# EAGLE design carrier v2.1 (EAGLE 9.1.1)
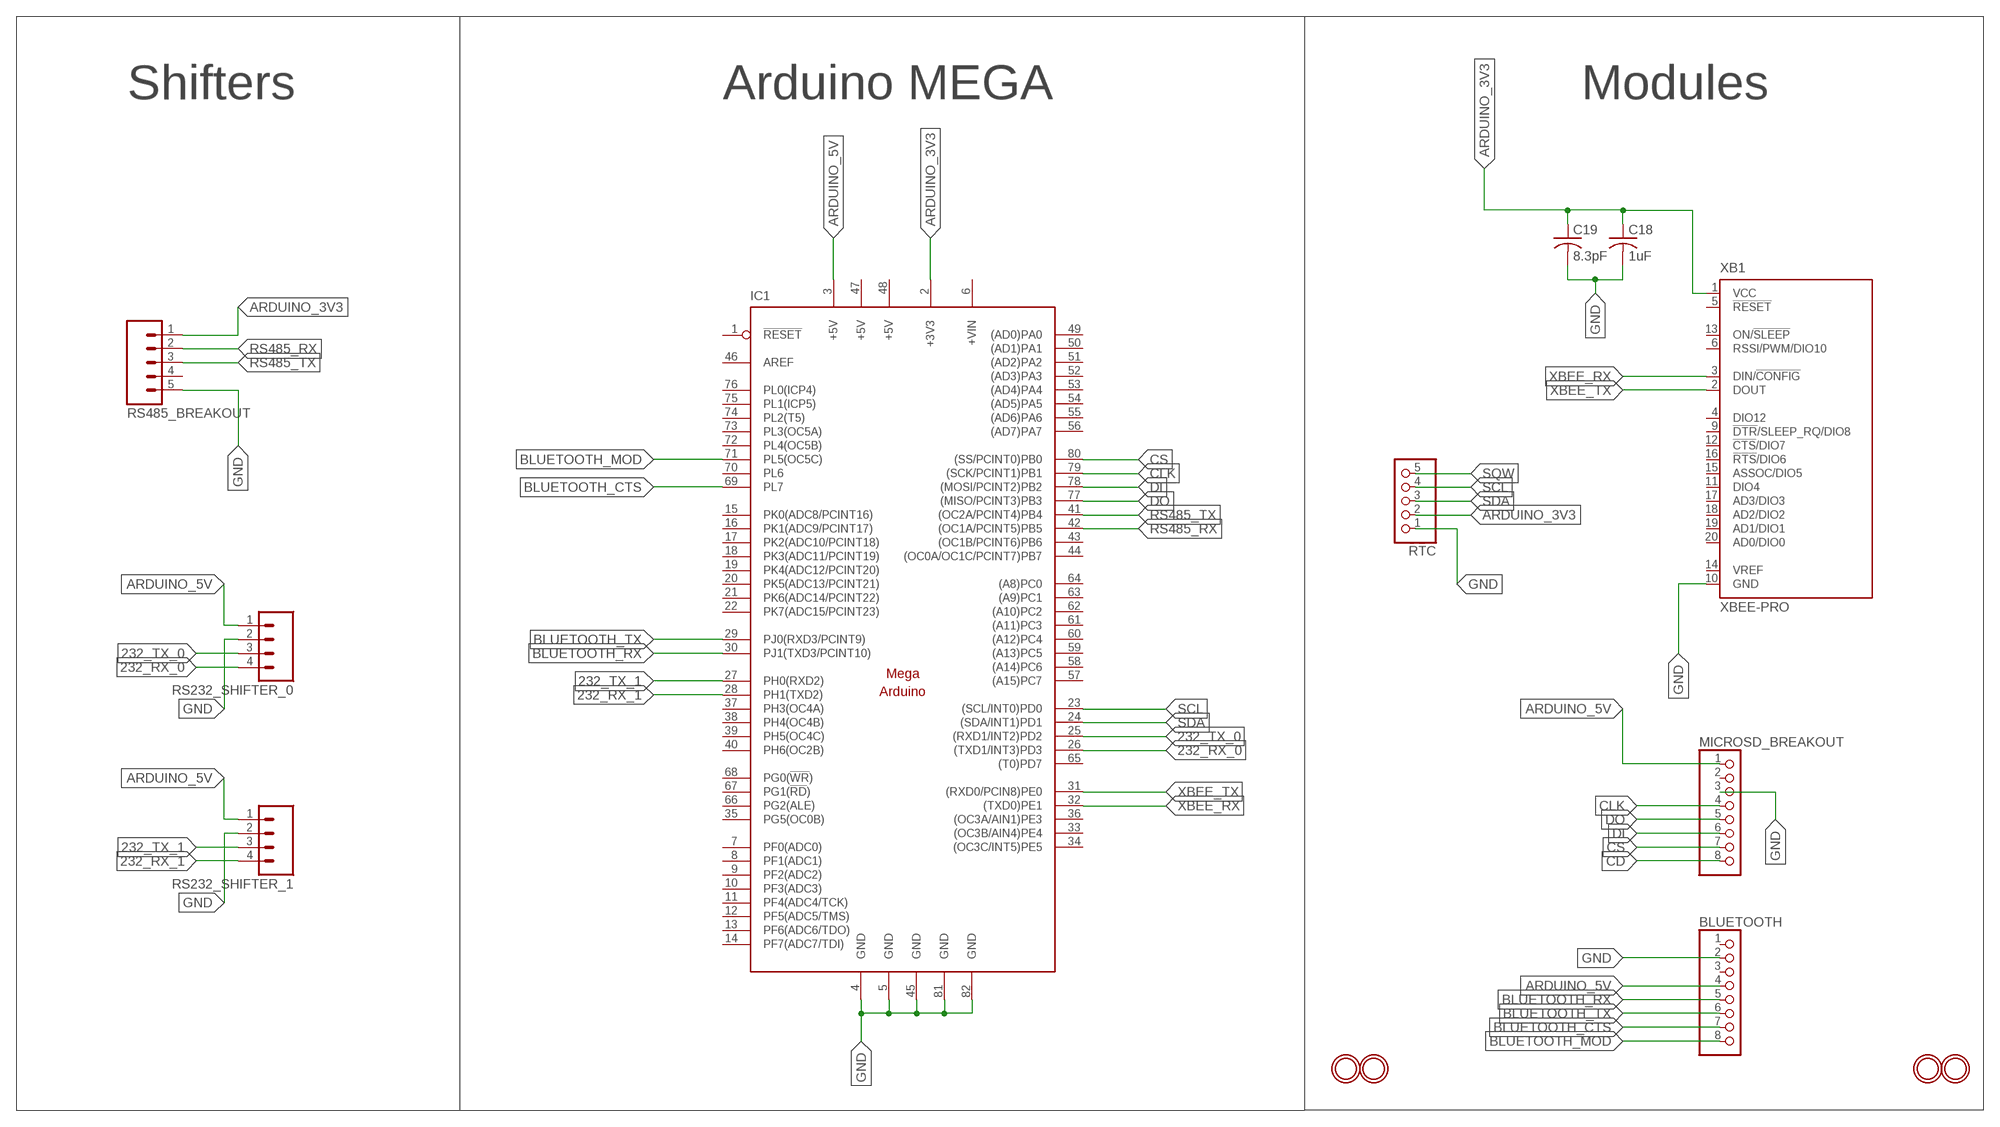
[diagram p0: schematic, sheet 1]

## Parts
BLUETOOTH  HEADER-1X876MIL  [1X08_ROUND_76]
C18  1uF  C-USC0805  [C0805]
C19  8.3pF  C-USC0805  [C0805]
IC1  MEGAARDUINO_1  [MEGA_ARDUINO]
MICROSD_BREAKOUT  PINHD-1X8BIG  [1X08-BIG]
RS232_SHIFTER_0  M04PTH  [1X04]
RS232_SHIFTER_1  M04PTH  [1X04]
RS485_BREAKOUT  M05PTH  [1X05]
RTC  HEADER-1X576MIL  [1X05_ROUND_76]
U$1  MOUNTINGHOLE2.0  [MOUNTINGHOLE_2.0_PLATED]
U$4  MOUNTINGHOLE2.0  [MOUNTINGHOLE_2.0_PLATED]
U$28  MOUNTINGHOLE2.5  [MOUNTINGHOLE_2.5_PLATED]
U$29  MOUNTINGHOLE2.5  [MOUNTINGHOLE_2.5_PLATED]
XB1  XBEE-PRO  [XBEE-PRO]

## Nets
232_RX_0: IC1.26((TXD1/INT3)PD3) RS232_SHIFTER_0.4
232_RX_1: IC1.28(PH1(TXD2)) RS232_SHIFTER_1.4
232_TX_0: IC1.25((RXD1/INT2)PD2) RS232_SHIFTER_0.3
232_TX_1: IC1.27(PH0(RXD2)) RS232_SHIFTER_1.3
ARDUINO_3V3: C18.1 C19.1 IC1.2(+3V3) RS485_BREAKOUT.1 RTC.2 XB1.1(VCC)
ARDUINO_5V: BLUETOOTH.4 IC1.3(+5V) MICROSD_BREAKOUT.1 RS232_SHIFTER_0.1 RS232_SHIFTER_1.1
BLUETOOTH_CTS: BLUETOOTH.7 IC1.69(PL7)
BLUETOOTH_MOD: BLUETOOTH.8 IC1.71(PL5(OC5C))
BLUETOOTH_RX: BLUETOOTH.5 IC1.30(PJ1(TXD3/PCINT10))
BLUETOOTH_TX: BLUETOOTH.6 IC1.29(PJ0(RXD3/PCINT9))
CD: MICROSD_BREAKOUT.8
CLK: IC1.79((SCK/PCINT1)PB1) MICROSD_BREAKOUT.4
CS: IC1.80((SS/PCINT0)PB0) MICROSD_BREAKOUT.7
DI: IC1.78((MOSI/PCINT2)PB2) MICROSD_BREAKOUT.6
DO: IC1.77((MISO/PCINT3)PB3) MICROSD_BREAKOUT.5
GND: BLUETOOTH.2 C18.2 C19.2 IC1.4(GND) IC1.5(GND) IC1.45(GND) IC1.81(GND) IC1.82(GND) MICROSD_BREAKOUT.3 RS232_SHIFTER_0.2 RS232_SHIFTER_1.2 RS485_BREAKOUT.5 RTC.1 XB1.10(GND)
RS485_RX: IC1.42((OC1A/PCINT5)PB5) RS485_BREAKOUT.2
RS485_TX: IC1.41((OC2A/PCINT4)PB4) RS485_BREAKOUT.3
SCL: IC1.23((SCL/INT0)PD0) RTC.4
SDA: IC1.24((SDA/INT1)PD1) RTC.3
SQW: RTC.5
XBEE_RX: IC1.32((TXD0)PE1) XB1.3(DIN/!CONFIG)
XBEE_TX: IC1.31((RXD0/PCIN8)PE0) XB1.2(DOUT)
Unconnected: BLUETOOTH.1 BLUETOOTH.3 IC1.1(!RESET) IC1.7(PF0(ADC0)) IC1.8(PF1(ADC1)) IC1.9(PF2(ADC2)) IC1.10(PF3(ADC3)) IC1.11(PF4(ADC4/TCK)) IC1.12(PF5(ADC5/TMS)) IC1.13(PF6(ADC6/TDO)) IC1.14(PF7(ADC7/TDI)) IC1.15(PK0(ADC8/PCINT16)) IC1.16(PK1(ADC9/PCINT17)) IC1.17(PK2(ADC10/PCINT18)) IC1.18(PK3(ADC11/PCINT19)) IC1.19(PK4(ADC12/PCINT20)) IC1.20(PK5(ADC13/PCINT21)) IC1.21(PK6(ADC14/PCINT22)) IC1.22(PK7(ADC15/PCINT23)) IC1.33((OC3B/AIN4)PE4) IC1.34((OC3C/INT5)PE5) IC1.35(PG5(OC0B)) IC1.36((OC3A/AIN1)PE3) IC1.37(PH3(OC4A)) IC1.38(PH4(OC4B)) IC1.39(PH5(OC4C)) IC1.40(PH6(OC2B)) IC1.43((OC1B/PCINT6)PB6) IC1.44((OC0A/OC1C/PCINT7)PB7) IC1.46(AREF) IC1.49((AD0)PA0) IC1.50((AD1)PA1) IC1.51((AD2)PA2) IC1.52((AD3)PA3) IC1.53((AD4)PA4) IC1.54((AD5)PA5) IC1.55((AD6)PA6) IC1.56((AD7)PA7) IC1.57((A15)PC7) IC1.58((A14)PC6) IC1.59((A13)PC5) IC1.60((A12)PC4) IC1.61((A11)PC3) IC1.62((A10)PC2) IC1.63((A9)PC1) IC1.64((A8)PC0) IC1.65((T0)PD7) IC1.66(PG2(ALE)) IC1.67(PG1(!RD!)) IC1.68(PG0(!WR!)) IC1.70(PL6) IC1.72(PL4(OC5B)) IC1.73(PL3(OC5A)) IC1.74(PL2(T5)) IC1.75(PL1(ICP5)) IC1.76(PL0(ICP4)) MICROSD_BREAKOUT.2 RS485_BREAKOUT.4 XB1.4(DIO12) XB1.5(!RESET) XB1.6(RSSI/PWM/DIO10) XB1.9(!DTR!/SLEEP_RQ/DIO8) XB1.11(DIO4) XB1.12(!CTS!/DIO7) XB1.13(ON/!SLEEP) XB1.14(VREF) XB1.15(ASSOC/DIO5) XB1.16(!RTS!/DIO6) XB1.17(AD3/DIO3) XB1.18(AD2/DIO2) XB1.19(AD1/DIO1) XB1.20(AD0/DIO0)

## Notes on the sheet
- Shifters | Arduino MEGA | Modules

## Power pins joined to a net without a drawn wire
+5V: IC1.47(+5V) IC1.48(+5V)
+VIN: IC1.6(+VIN)

## Library data of the parts
BLUETOOTH = microbuilder:HEADER-1X8: PIN HEADER
C18 C19 = resistor:C-US: CAPACITOR, American symbol
IC1 = arduino:MEGAARDUINO_1: The Arduino Mega is a microcontroller board based on the ATmega1280. - 54 digital input/output pins (of which 14 can be used as PWM outputs) - 16 analog inputs - 4 UARTs (hardware serial ports) - 16 MHz crystal oscillator - USB connection - power jack - ICSP header - reset button It contains everything needed to support the microcontroller; simply connect it to a computer with a USB cable or power it with a AC-to-DC adapter or battery to get started. The Mega is compatible with most shields designed for the Arduino Duemilanove or Diecimila. http://arduino.cc/en/Main/ArduinoBoardMega
MICROSD_BREAKOUT = adafruit:PINHD-1X8: PIN HEADER
RS232_SHIFTER_0 RS232_SHIFTER_1 = SparkFun-Connectors:M04: Header 4 Standard 4-pin 0.1" header. Use with straight break away headers (SKU : PRT-00116), right angle break away headers (PRT-00553), swiss pins (PRT-00743), machine pins (PRT-00117), and female headers (PRT-00115). Molex polarized connector foot print use with SKU : PRT-08231 with associated crimp pins and housings. 1MM SMD Version SKU: PRT-10208
RS485_BREAKOUT = SparkFun:M05: Header 5 Standard 5-pin 0.1" header. Use with straight break away headers (SKU : PRT-00116), right angle break away headers (PRT-00553), swiss pins (PRT-00743), machine pins (PRT-00117), and female headers (PRT-00115). Molex polarized connector foot print use with SKU : PRT-08230 with associated crimp pins and housings.
RTC = microbuilder:HEADER-1X5: PIN HEADER
U$1 U$4 U$28 U$29 = microbuilder:MOUNTINGHOLE: Mounting Hole For #2 screws (0.086"/2.18mm width, 0.094"/2.4mm hole) use 2.5mm; BOM: EXCLUDE
XB1 = xbee:XBEE: XBee (TM) /XBee-PRO(TM) OEM RF Modules Source: MaxStream, Inc. xbee_productmanual.pdf; MPN: XBP24-AWI-001; OC_FARNELL: 1337916; OC_NEWARK: 42M2667

## Net classes
1 power: width 0.254 mm

## Board
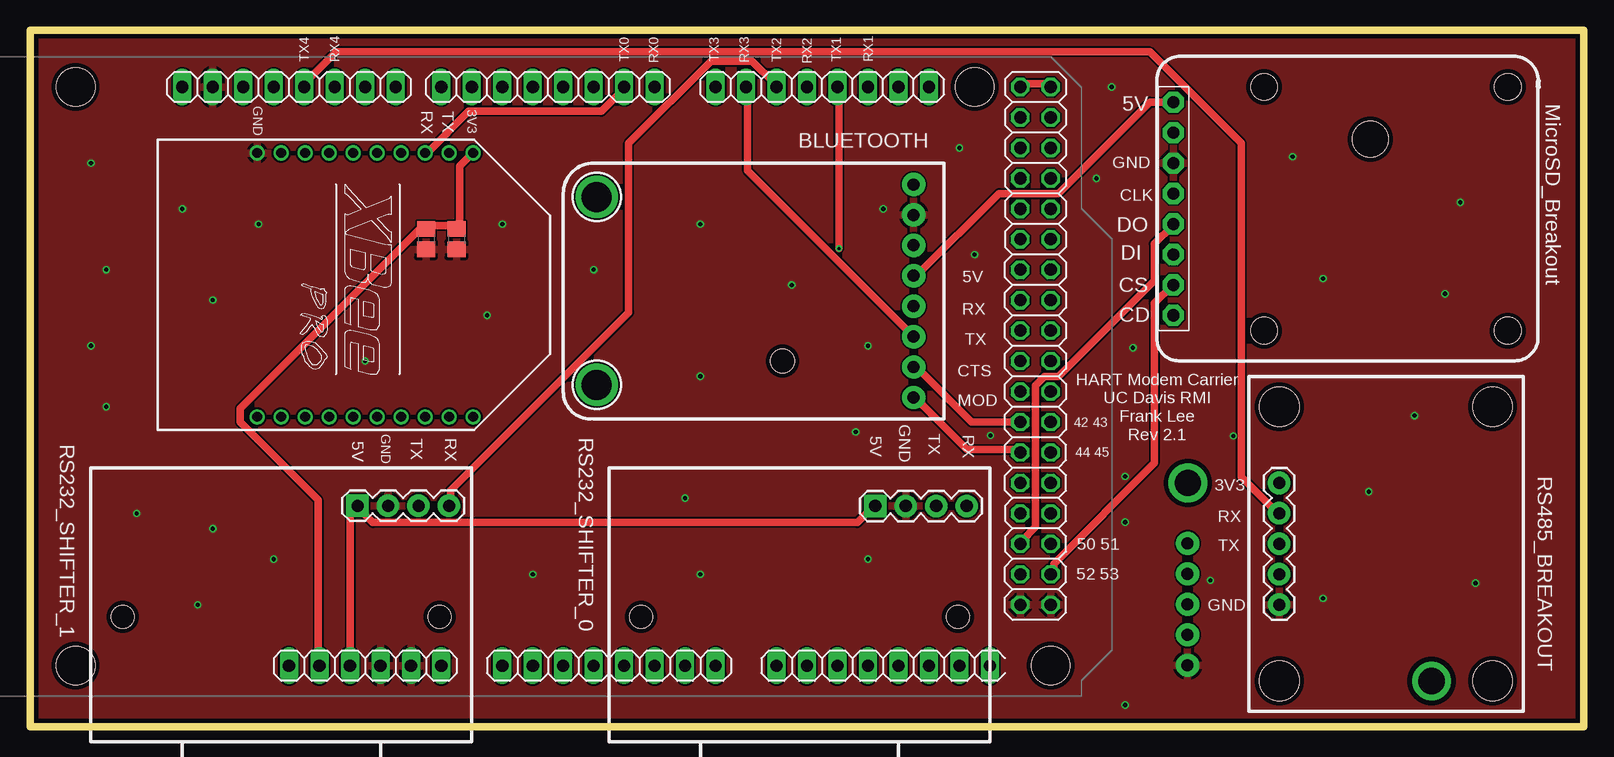
[diagram p1: board, top side]
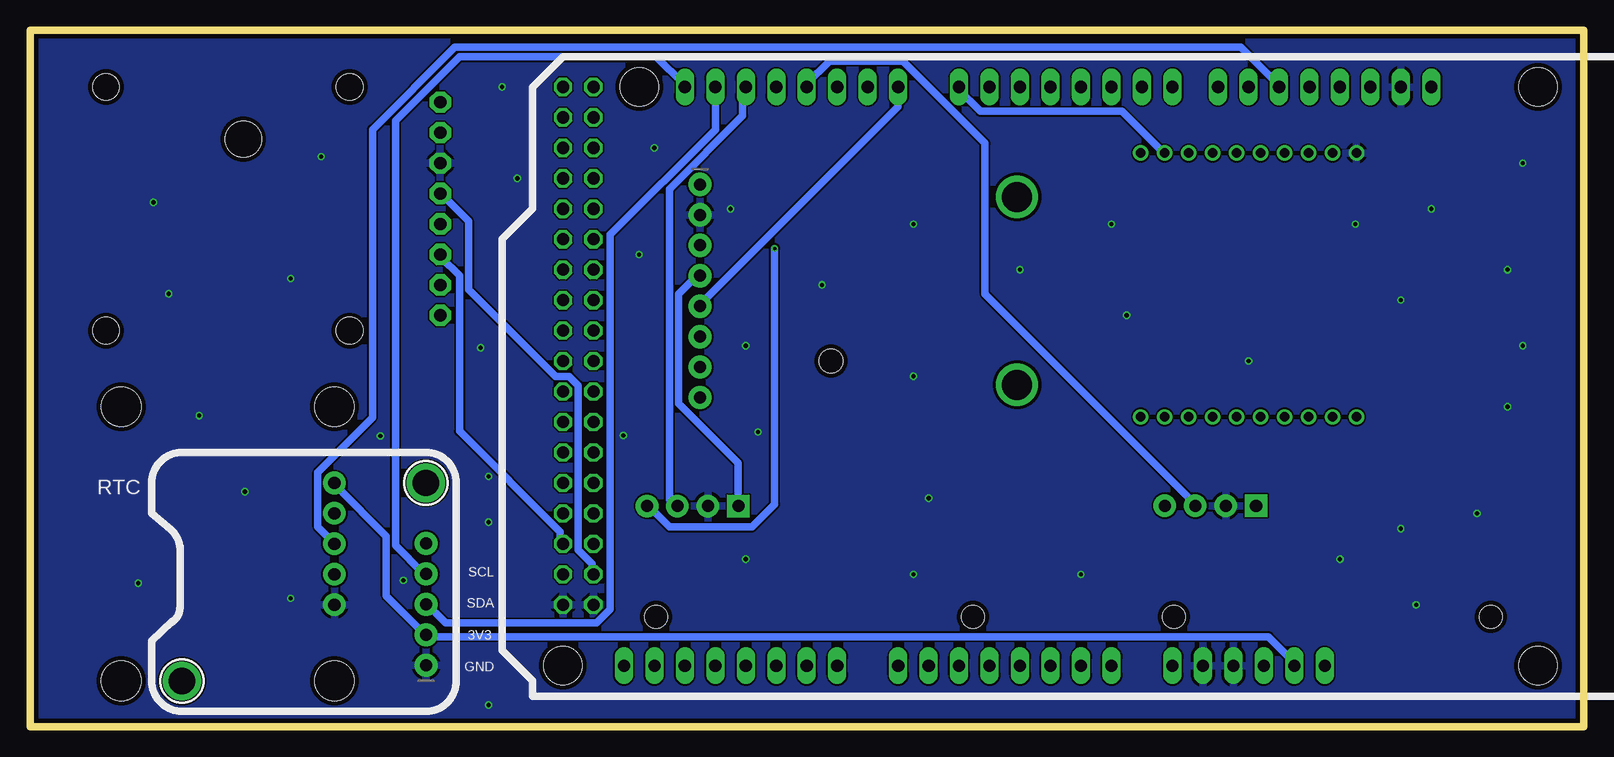
[diagram p2: board, bottom side, seen from below]

Size 129.52 x 58.09 mm. Coordinates in mm from the lower left corner, seen from the top.
Outline: 0,0 129.52,0 129.52,58.09 0,58.09 0,0
Copper layers (1*16): Top 0.035559375mm / dielectric 1.6mm / Bottom 0.035559375mm
Design rules "oshpark-2layer *": minimum track width 24mil, minimum drill 10mil, track to track 6mil, track to pad 6mil, pad to pad 6mil, via to via 6mil, smd to smd 6mil, copper to edge 15mil, drill to drill 6mil, minimum pad ring 5mil, minimum via ring 5mil, stop-mask expansion 2.5mil, vias tented up to drill 0mil, thermal gap 10mil
Holes 1.91 mm at 7.75,9.14 34.16,9.14 50.93,9.14 77.34,9.14
Holes 2.21 mm at 123.19,53.34 123.19,33.02 102.87,33.02 102.87,53.34
Holes 3 mm at 111.73,49

### Footprints (pad centres in the part's own frame; a part is rotated, then mirrored left to right if it is on the bottom)
1X08_ROUND_76 = drill 1 pad 1.93: 1 -8.89,0; 2 -6.35,0; 3 -3.81,0; 4 -1.27,0; 5 1.27,0; 6 3.81,0; 7 6.35,0; 8 8.89,0
C0805 = smd 1.3 x 1.5: 1 -0.85,0; 2 0.85,0
MEGA_ARDUINO = drill 1.016 long: 1 33.02,2.54; 2 35.56,2.54; 3 38.1,2.54; 4 40.64,2.54; 5 43.18,2.54; 6 45.72,2.54; 7 50.8,2.54; 8 53.34,2.54; 9 55.88,2.54; 10 58.42,2.54; 11 60.96,2.54; 12 63.5,2.54; 13 66.04,2.54; 14 68.58,2.54; 15 73.66,2.54; 16 76.2,2.54; 17 78.74,2.54; 18 81.28,2.54; 19 83.82,2.54; 20 86.36,2.54; 21 88.9,2.54; 22 91.44,2.54; 23 86.36,50.8; 24 83.82,50.8; 25 81.28,50.8; 26 78.74,50.8; 27 76.2,50.8; 28 73.66,50.8; 29 71.12,50.8; 30 68.58,50.8; 31 63.5,50.8; 32 60.96,50.8; 33 58.42,50.8; 34 55.88,50.8; 35 53.34,50.8; 36 50.8,50.8; 37 48.26,50.8; 38 45.72,50.8; 39 41.91,50.8; 40 39.37,50.8; 41 36.83,50.8; 42 34.29,50.8; 43 31.75,50.8; 44 29.21,50.8; 45 26.67,50.8; 46 24.13,50.8 | drill 1.016 octagon: 47 93.98,50.8; 48 96.52,50.8; 49 93.98,48.26; 50 96.52,48.26; 51 93.98,45.72; 52 96.52,45.72; 53 93.98,43.18; 54 96.52,43.18; 55 93.98,40.64; 56 96.52,40.64; 57 93.98,38.1; 58 96.52,38.1; 59 93.98,35.56; 60 96.52,35.56; 61 93.98,33.02; 62 96.52,33.02; 63 93.98,30.48; 64 96.52,30.48; 65 93.98,27.94; 66 96.52,27.94; 67 93.98,25.4; 68 96.52,25.4; 69 93.98,22.86; 70 96.52,22.86; 71 93.98,20.32; 72 96.52,20.32; 73 93.98,17.78; 74 96.52,17.78; 75 93.98,15.24; 76 96.52,15.24; 77 93.98,12.7; 78 96.52,12.7; 79 93.98,10.16; 80 96.52,10.16; 81 93.98,7.62; 82 96.52,7.62 | hole 3.2: 15.24,50.8; 15.24,2.54; 90.17,50.8; 96.52,2.54 | hole 2: 74.168,27.94
STAND-OFF = hole 3.302: 0,0
1X08-BIG = drill 1.016 pad 1.778 octagon: 1 -8.89,0; 2 -6.35,0; 3 -3.81,0; 4 -1.27,0; 5 1.27,0; 6 3.81,0; 7 6.35,0; 8 8.89,0
1X04 = drill 1.016 pad 1.88 square: 1 0,0 | drill 1.016 pad 1.88: 2 2.54,0; 3 5.08,0; 4 7.62,0
1X05 = drill 1.016 pad 1.88: 1 0,0; 2 2.54,0; 3 5.08,0; 4 7.62,0; 5 10.16,0
1X05_ROUND_76 = drill 1 pad 1.93: 1 -5.08,0; 2 -2.54,0; 3 0,0; 4 2.54,0; 5 5.08,0
MOUNTINGHOLE_2.0_PLATED = drill 2.2 pad 3: P$1 0,0
MOUNTINGHOLE_2.5_PLATED = drill 2.5 pad 3.2: P$1 0,0
XBEE-PRO = drill 0.8 pad 1.27: 1 -11,9; 2 -11,7; 3 -11,5; 4 -11,3; 5 -11,1; 6 -11,-1; 7 -11,-3; 8 -11,-5; 9 -11,-7; 10 -11,-9; 11 11,-9; 12 11,-7; 13 11,-5; 14 11,-3; 15 11,-1; 16 11,1; 17 11,3; 18 11,5; 19 11,7; 20 11,9

### Placement (x,y rotation side)
BLUETOOTH  73.66,36.32 270 bottom
C18  33.02,40.64 270 top
C19  35.56,40.64 270 top
IC1  -11.43,2.54 0 top
JP6  STAND-OFF  [STAND-OFF]  104.14,3.81 0 top
JP7  STAND-OFF  [STAND-OFF]  121.92,26.67 0 top
JP8  STAND-OFF  [STAND-OFF]  121.92,3.81 0 top
JP15  STAND-OFF  [STAND-OFF]  104.14,26.67 0 top
MICROSD_BREAKOUT  95.31,43.18 270 top
RS232_SHIFTER_0  70.46,18.4 0 top
RS232_SHIFTER_1  27.3,18.41 0 top
RS485_BREAKOUT  104.14,20.32 270 top
RTC  96.49,10.19 90 bottom
U$1  96.52,20.32 90 bottom
U$4  116.84,3.81 90 bottom
U$28  47.24,44.17 270 top
U$29  47.24,28.5 270 top
XB1  27.94,36.83 270 top

### Tracks (layer width: path | path; a pad name or v marks a point on that pad's centre or on a via)
232_RX_0  (via drill 0.25)
  Top 0.61: v67.44,39.88 67.44,53.21 IC1.26
  Bottom 0.61: v67.44,39.88 67.44,18.54 69.34,16.64 76.2,16.64 77.72,18.16 RS232_SHIFTER_0.4
232_RX_1
  Top 0.61: IC1.28 62.1,53.59 60.2,55.5 56.77,55.5 49.91,48.64 49.91,34.54 35.05,19.68 35.05,18.54 RS232_SHIFTER_1.4
232_TX_0
  Bottom 0.61: IC1.25 70.1,53.21 70.1,50.93 76.2,44.83 76.2,18.92 75.82,18.54 RS232_SHIFTER_0.3
232_TX_1
  Bottom 0.61: IC1.27 64.77,53.59 62.87,55.5 56.77,55.5 49.91,48.64 49.91,36.07 32.38,18.54 RS232_SHIFTER_1.3
+5V
  Top 0.61: IC1.47 82.68,53.59 84.96,53.59 IC1.48
ARDUINO_3V3
  Top 0.61: XB1.1 36.58,47.5 35.81,46.74 35.81,41.78 C19.1 35.43,41.78 33.15,41.78 C18.1 32.77,41.78 17.53,26.54 17.53,25.4 24,18.92 24,5.21 IC1.2
  Bottom 0.61: RS485_BREAKOUT.1 104.01,20.07 99.82,15.88 99.82,10.92 96.77,7.87 RTC.2 96.39,7.49 26.29,7.49 24,5.21 IC1.2
ARDUINO_5V
  Top 0.61: IC1.3 26.67,5.21 26.67,17.78 27.05,18.16 RS232_SHIFTER_1.1 27.43,18.16 28.58,17.02 68.96,17.02 70.1,18.16 RS232_SHIFTER_0.1 | MICROSD_BREAKOUT.1 95.25,52.07 93.34,52.07 85.72,44.45 80.77,44.45 73.91,37.59 BLUETOOTH.4
  Bottom 0.61: RS232_SHIFTER_0.1 70.49,18.54 70.49,21.97 75.44,26.92 75.44,36.07 73.91,37.59 BLUETOOTH.4
BLUETOOTH_CTS
  Top 0.61: IC1.69 82.3,25.4 78.49,25.4 73.91,29.97 BLUETOOTH.7
BLUETOOTH_MOD
  Top 0.61: IC1.71 82.3,23.11 78.1,23.11 73.91,27.3 BLUETOOTH.8
BLUETOOTH_RX
  Bottom 0.61: IC1.30 57.15,53.21 57.15,51.69 73.53,35.31 BLUETOOTH.5
BLUETOOTH_TX
  Top 0.61: IC1.29 59.82,53.21 59.82,46.35 73.53,32.64 BLUETOOTH.6
CLK
  Bottom 0.61: IC1.79 82.68,12.83 82.68,13.59 83.82,14.73 83.82,28.45 84.58,29.21 85.72,29.21 92.96,36.45 92.96,42.16 95.25,44.45 MICROSD_BREAKOUT.4
CS
  Top 0.61: IC1.80 85.34,12.83 85.34,13.59 93.73,21.97 93.73,35.31 95.25,36.83 MICROSD_BREAKOUT.7
DI
  Bottom 0.61: IC1.78 85.34,15.49 85.34,16.26 93.73,24.64 93.73,37.59 95.25,39.12 MICROSD_BREAKOUT.6
DO
  Top 0.61: IC1.77 82.68,15.49 83.82,16.64 83.82,28.45 84.58,29.21 85.72,29.21 93.73,37.21 93.73,40.26 95.25,41.78 MICROSD_BREAKOUT.5
GND  (via drill 0.35)
  other vias: 5.08,46.99 6.35,38.1 12.7,43.18 19.05,41.91 15.24,35.56 5.08,31.75 6.35,26.67 8.89,17.78 15.24,16.51 13.97,10.16 20.32,13.97 27.94,30.48 38.1,34.29 39.37,41.91 46.99,38.1 55.88,41.91 63.5,36.83 69.85,31.75 68.83,24.56 55.88,29.21 54.61,19.05 55.88,12.7 69.85,13.97 41.91,12.7 78.74,39.37 71.12,43.18 77.47,48.26 90.17,53.34 88.9,45.72 91.29,20.85 91.29,17.04 91.29,1.8 107.8,10.69 120.5,11.96 111.61,19.58 115.42,25.93 107.8,37.36 119.23,43.71 117.96,36.09 105.26,47.52 80.06,24.28 91.95,31.6 98.4,12.19 100.3,24.23
  pour Top: -36.83,92.71 158.75,92.71 158.75,-24.13 -36.83,-24.13
  pour Bottom: -30.48,78.74 151.13,78.74 151.13,-26.67 -30.48,-26.67
RS485_RX
  Top 0.61: IC1.42 22.86,53.59 25.53,56.26 93.34,56.26 100.97,48.64 100.97,20.83 104.01,17.78 RS485_BREAKOUT.2
RS485_TX
  Bottom 0.61: IC1.41 25.53,53.59 28.58,56.64 94.11,56.64 100.97,49.78 100.97,25.78 105.54,21.21 105.54,16.64 104.39,15.49 RS485_BREAKOUT.3
SCL
  Bottom 0.61: IC1.23 75.06,53.59 77.34,55.88 93.73,55.88 99.06,50.55 99.06,15.11 96.77,12.83 RTC.4
SDA
  Bottom 0.61: IC1.24 72.39,53.21 72.39,49.78 81.15,41.02 81.15,9.78 82.3,8.64 94.87,8.64 96.39,10.16 RTC.3
XBEE_RX
  Top 0.61: XB1.3 33.15,47.88 36.58,51.31 47.62,51.31 49.53,53.21 IC1.32
XBEE_TX
  Bottom 0.61: XB1.2 35.05,47.88 38.48,51.31 50.29,51.31 52.2,53.21 IC1.31

### Text on the board
tPlace: TX4 | TX0 | RX0 | TX3 | RX3 | TX2 | RX2 | TX1 | RX1 | GND | RX | TX | 3V3 | 5V | MicroSD_Breakout | BLUETOOTH | GND | CLK | DO | DI | 5V | CS | RX | CD | TX | CTS | MOD | GND | GND | TX | RX | RS232_SHIFTER_0 | 5V | TX | RX | 42 43 | 5V | HART Modem Carrier / UC Davis RMI / Frank Lee / Rev 2.1 | 44 45 | 3V3 | RX | 50 51 | TX | 52 53 | GND
bPlace: RTC | SCL | SDA | 3V3 | GND
tNames: RX4